# EasyEDA Pro project 宿舍管理.eprj

# Schematic Schematic1
Create Date: 2023-12-03; Page Name: P1; Project Name: 宿舍管理; Schematic Name: Schematic1; Update Date: 2023-12-23; Company: 嘉立创EDA; Page Size: A4; Version: V1.0
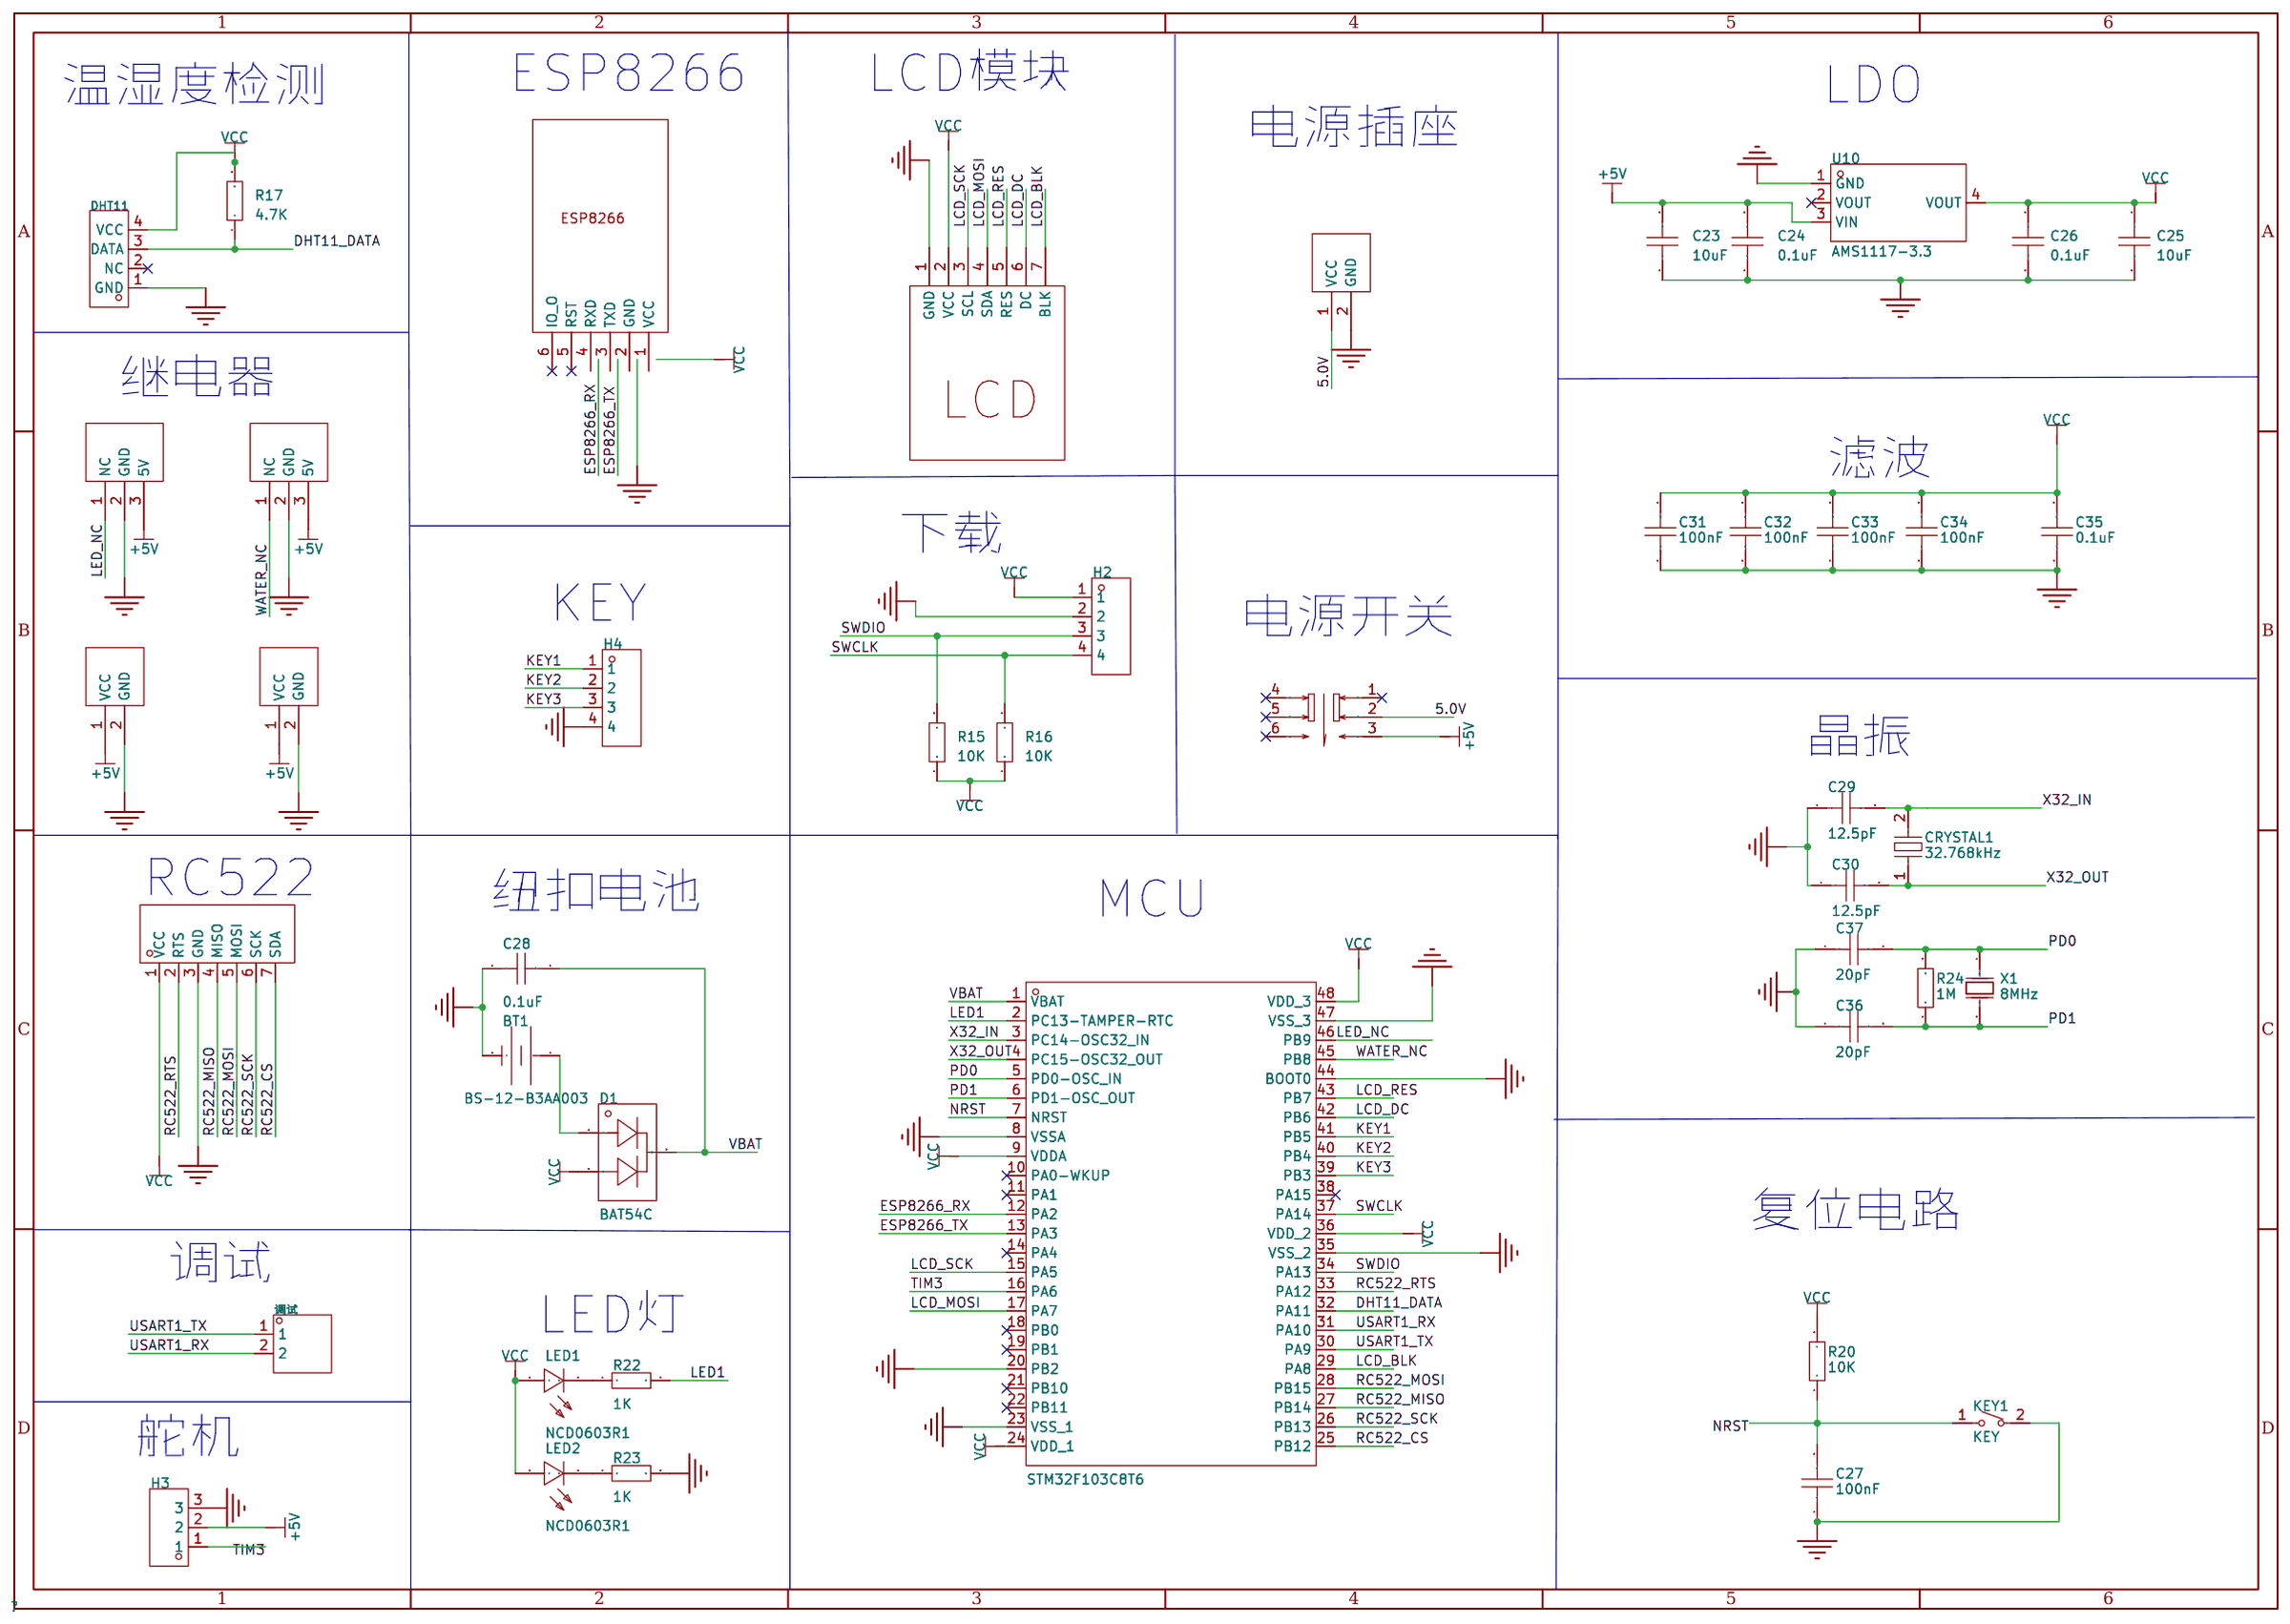
[diagram p0: schematic sheet]

## Parts
BT1  BS-12-B3AA003  [BAT-SMD_BS-12-B3AA011]
C23  10uF  [C0603]
C24  0.1uF  [C0603]
C25  10uF  [C0603]
C26  0.1uF  [C0603]
C27  100nF  [C0603]
C28  0.1uF  [C0603]
C29  12.5pF  [C0603]
C30  12.5pF  [C0603]
C31  100nF  [C0603]
C32  100nF  [C0603]
C33  100nF  [C0603]
C34  100nF  [C0603]
C35  0.1uF  [C0603]
C36  20pF  [C0603]
C37  20pF  [C0603]
CRYSTAL1  32.768kHz  [CRYSTAL-SMD_L3.2-W1.5-FC-135R32.7680KF-A3]
D1  BAT54C  [SOT-23-3_L2.9-W1.4-P1.91-LS2.6-BR]
DHT11  -  [HDR-TH_4P-P2.54-V-F]
H1  -  [HDR-TH_7P-P2.54-V-M]
H2  -  [HDR-TH_4P-P2.54-V-M]
H3  -  [HDR-TH_3P-P2.54-V-M]
H4  -  [HDR-TH_4P-P2.54-V-M]
KEY1  KEY  [SW-SMD_L6.0-W3.7-LS8.0]
LED1  NCD0603R1  [LED0603-RD_RED]
LED2  NCD0603R1  [LED0603-RD_RED]
R15  10K  [R0603]
R16  10K  [R0603]
R17  4.7K  [R0603]
R20  10K  [R0603]
R22  1K  [R0603]
R23  1K  [R0603]
R24  1M  [R0603]
SW1  TK-6700-1  [SW-TH_TK-6700-1]
U1  -  [正点原子ESP8266]
U2  -  [LCD-TFT]
U3  -  [电源2Pin]
U5  -  [电源3Pin]
U6  -  [电源3Pin]
U7  -  [电源2Pin]
U8  -  [电源2Pin]
U9  STM32F103C8T6  [LQFP-48_L7.0-W7.0-P0.50-LS9.0-BL]
U10  AMS1117-3.3  [SOT-223-3_L6.5-W3.4-P2.30-LS7.0-BR]
X1  8MHz  [CRYSTAL-SMD_L11.5-W4.8-LS12.7]
调试  -  [HDR-TH_2P-P2.54-V-M-1]

## Library data of the parts
BT1 = BS-12-B3AA003: 连接器类型:电池底座;适用电池规格:CR1220;工作温度范围:-25℃~+85℃;; LCSC Part Name: 电池底座 适用电池:CR1220; Supplier Part: C964723; Manufacturer: MYOUNG(美阳); Supplier Footprint: SMD; Datasheet: https://atta.szlcsc.com/upload/public/pdf/source/20201218/C964723_733B638E287393F86295A2A4DAE43C75.pdf; Supplier: LCSC; Connector Type: 电池底座; Battery Type: CR1220; Operating Temperature Range: -25℃~+85℃
C23-C37 = CAP_0603: Supplier Footprint: 0603
CRYSTAL1 = DF2032K76812001: 频率:32.768kHz;负载电容:12.5pF;频率公差:±20ppm;; LCSC Part Name: 32.768kHz ±20ppm 12.5pF; Supplier Part: C7294751; Manufacturer: HUAXIN(华昕); Supplier Footprint: SMD3215-2P; Datasheet: https://atta.szlcsc.com/upload/public/pdf/source/20230621/65B4E44CEC9FC4E2CAB0C2FAC7F63C7F.pdf; Supplier: LCSC; Crystal Type: 贴片无源晶振; Load Capacitance: 12.5pF; Equivalent Series Resistance (ESR): 60kΩ; Frequency Tolerance: ±20ppm; Frequency Stability: ±30ppm; Operating Temperature: -40℃~+85℃
D1 = BAT54C_C727125: 二极管配置:1对共阴极;正向压降(Vf):1V@100mA;直流反向耐压(Vr):30V;平均整流电流(Io):200mA;; LCSC Part Name: 电压:30V 电流:200mA; Supplier Part: C727125; Manufacturer: TWGMC(台湾迪嘉); Supplier Footprint: SOT-23; Datasheet: https://atta.szlcsc.com/upload/public/pdf/source/20200827/C727125_FA9D830E6485A4AEFAD08726CE8D43AC.pdf; Supplier: LCSC; Diode Configuration: 1对共阴极; Forward Voltage (Vf@If): 1V@100mA; Reverse Voltage (Vr): 30V; Average Rectified Current (Io): 200mA; Reverse Leakage Current (Ir): 2uA@25V
DHT11 = HDR-F_2.54_1x4P: Supplier Part: C2718488; Supplier Footprint: 插件; Supplier: LCSC; Manufacturer: BOOMELE(博穆精密); Manufacturer Part: 2.54-1*4P母; JLCPCB Part Class: Extended Part
H1 = HDR-M_2.54_1x7P: Supplier Part: C492406; Supplier Footprint: 插件; Supplier: LCSC; Manufacturer: XFCN(兴飞); Manufacturer Part: PZ254V-11-07P; JLCPCB Part Class: Extended Part
H2 H4 = HDR-M_2.54_1x4P: Supplier Part: C492403; Supplier Footprint: 插件
H3 = HDR-M_2.54_1x3P: Supplier Part: C2937625; Supplier Footprint: 插件
KEY1 = KEY: Supplier Part: C9900023212; Supplier Footprint: SW-SMD-2P; JLCPCB Part Class: 扩展库; Supplier: LCSC
LED1 LED2 = NCD0603R1_C84263: 发光颜色:红色;功率:65mW;透镜颜色:无色透明;主波长:615nm~630nm;发光强度:80mcd~220mcd;发光角度:130°;工作温度:-30℃~+85℃;; LCSC Part Name: 红灯 0603红灯   正贴; Supplier Part: C84263; Manufacturer: 国星光电; Supplier Footprint: 0603; JLCPCB Part Class: Extended Part; Datasheet: https://atta.szlcsc.com/upload/public/pdf/source/20200820/C84263_DABC6A75E58F576973B407FDBA283D60.pdf; Supplier: LCSC; Emitted Color: 红色; Forward Voltage (VF): 1.6V~2.6V; Forward Current: 20mA; Power Dissipation: 65mW; Lens Color: 无色透明; Dominant Wavelength: 615nm~630nm; Luminous Intensity: 80mcd~220mcd; Viewing Angle: 130°; Operating Temperature: -30℃~+85℃
R15-R17 R20 R22-R24 = Res_0603: Supplier Footprint: 0603
SW1 = TK-6700-1: LCSC Part Name: 自锁开关7*7*12.7有声有锁高导高柄插件双排6P按键开关带锁DIP六脚; Supplier Part: C528782; Manufacturer: Yuandi(元迪); Supplier Footprint: 插件; Datasheet: https://atta.szlcsc.com/upload/public/pdf/source/20200831/C528782_58F076EBF84BD8A9E2DE38DB1C0986D4.pdf; Supplier: LCSC
U1 = 正点原子ESP8266
U2 = LCD-TFT
U3 U7 U8 = 电源2Pin
U5 U6 = 电源3Pin
U9 = STM32F103C8T6: CPU内核:ARM Cortex-M3;CPU最大主频:72MHz;工作电压范围:2V~3.6V;程序存储容量:64KB;程序存储器类型:FLASH;RAM总容量:20KB;GPIO端口数量:37;; LCSC Part Name: STM32F103C8T6 MSL=3; Supplier Part: C8734; Manufacturer: ST(意法半导体); Supplier Footprint: LQFP-48(7x7); JLCPCB Part Class: 扩展库; Datasheet: https://atta.szlcsc.com/upload/public/pdf/source/20220812/8363ACEC51AD55ECEB84799464F7CB85.pdf; Supplier: LCSC; CPU Core: ARM Cortex-M3; CPU Maximum Speed: 72MHz; Operating Voltage Range: 2V~3.6V; Program Storage Size: 64KB; Program Memory Type: FLASH; RAM Size: 20KB; GPIO Ports Number: 37; ADC (Bit): 12bit; Universal Serial Bus: 有; Peripheral/Function: 看门狗；DMA；看门狗；片载温度传感器; Watchdog: 有; Infrared Data Association: 有; Low-Voltage Detect: 有; Direct Memory Access: 有; Internal Oscillator: 有; Operating Temperature Range: -40℃~+85℃
U10 = AMS1117-3.3_C6186: 输出类型:固定;最大输入电压:-;输出电压:3.3V;输出电流:1A;电源纹波抑制比(PSRR):72dB@(120Hz);输出极性:正;; LCSC Part Name: 输出3.3V 1A; Supplier Part: C6186; Manufacturer: AMS; Supplier Footprint: SOT-223-3; JLCPCB Part Class: 基础库; Datasheet: https://atta.szlcsc.com/upload/public/pdf/source/20180727/C6186_7A095716F0823C02F1997A905E26C086.pdf; Supplier: LCSC; Output Type: 固定; Output Voltage: 3.3V; Output Current: 1A; Power Supply Rejection Ratio (PSRR): 72dB@(120Hz); Dropout Voltage: 1.3V@(800mA); Output Polarity: 正; Number of Outputs: 1
X1 = X49SM8MSD2SC: 频率:8MHz;负载电容:20pF;频率公差:±20ppm;; LCSC Part Name: 8MHz ±20ppm 20pF HC-49SMD; Supplier Part: C12674; Manufacturer: YXC(扬兴晶振); Supplier Footprint: HC-49S-SMD; JLCPCB Part Class: 基础库; Datasheet: https://atta.szlcsc.com/upload/public/pdf/source/20210329/C106809_0E91E60850A780B284B63D653DC40EA4.pdf; Supplier: LCSC; Crystal Type: 49SMD; Load Capacitance: 20pF; Frequency Tolerance: ±20ppm; Frequency Stability: ±30ppm; Operating Temperature: -20℃~+70℃
调试 = HDR-M_2.54_1x2P: Supplier Part: C124375; Supplier Footprint: 插件

## Nets
5.0V: SW1.2 U3.1(VCC)
+5V: C23.2 C24.2 H3.2 SW1.3 U5.3(5V) U6.3(5V) U7.1(VCC) U8.1(VCC) U10.3(VIN)
GND: BT1.2(-) C23.1 C24.1 C25.2 C26.2 C27.1 C28.1 C29.1 C30.1 C31.1 C32.1 C33.1 C34.1 C35.1 C36.1 C37.1 DHT11.1(GND) H1.3(GND) H2.2 H3.3 H4.4 KEY1.2 R23.2 U2.1(GND) U3.2(GND) U5.2(GND) U6.2(GND) U7.2(GND) U8.2(GND) U9.8(VSSA) U9.20(PB2) U9.23(VSS_1) U9.35(VSS_2) U9.44(BOOT0) U9.47(VSS_3) U10.1(GND)
VBAT: C28.2 D1.3 U9.1(VBAT)
VCC: C25.1 C26.1 C31.2 C32.2 C33.2 C34.2 C35.2 D1.2 DHT11.4(VCC) H1.1(VCC) H2.1 LED1.2(A) LED2.2(A) R15.1 R16.1 R17.2 R20.2 U2.2(VCC) U9.9(VDDA) U9.24(VDD_1) U9.36(VDD_2) U9.48(VDD_3) U10.4(VOUT)
DHT11_DATA: DHT11.3(DATA) R17.1 U9.32(PA11)
ESP8266_RX: U9.12(PA2)
ESP8266_TX: U9.13(PA3)
KEY1: H4.1 U9.41(PB5)
KEY2: H4.2 U9.40(PB4)
KEY3: H4.3 U9.39(PB3)
LCD_BLK: U2.7(BLK) U9.29(PA8)
LCD_DC: U2.6(DC) U9.42(PB6)
LCD_MOSI: U2.4(SDA) U9.17(PA7)
LCD_RES: U2.5(RES) U9.43(PB7)
LCD_SCK: U2.3(SCL) U9.15(PA5)
LED1: R22.2 U9.2(PC13-TAMPER-RTC)
LED_NC: U5.1(NC) U9.46(PB9)
NRST: C27.2 KEY1.1 R20.1 U9.7(NRST)
PD0: C37.2 R24.2 U9.5(PD0-OSC_IN) X1.1(OSC1)
PD1: C36.2 R24.1 U9.6(PD1-OSC_OUT) X1.2(OSC2)
RC522_CS: H1.7(SDA) U9.25(PB12)
RC522_MISO: H1.4(MISO) U9.27(PB14)
RC522_MOSI: H1.5(MOSI) U9.28(PB15)
RC522_RTS: H1.2(RTS) U9.33(PA12)
RC522_SCK: H1.6(SCK) U9.26(PB13)
SWCLK: H2.4 R16.2 U9.37(PA14)
SWDIO: H2.3 R15.2 U9.34(PA13)
TIM3: H3.1 U9.16(PA6)
USART1_RX: U9.31(PA10) 调试.2
USART1_TX: U9.30(PA9) 调试.1
WATER_NC: U6.1(NC) U9.45(PB8)
X32_IN: C29.2 CRYSTAL1.2 U9.3(PC14-OSC32_IN)
X32_OUT: C30.2 CRYSTAL1.1 U9.4(PC15-OSC32_OUT)
$1N12932: BT1.1(+) D1.1
$1N13409: LED1.1(K) R22.1
$1N13480: LED2.1(K) R23.1

Not connected (* = marked no-connect by the designer): DHT11 2(NC)*; SW1 1* 4* 5* 6*; U1 1(VCC) 2(GND) 3(TXD) 4(RXD) 5(RST)* 6(IO_O)*; U9 10(PA0-WKUP)* 11(PA1)* 14(PA4)* 18(PB0)* 19(PB1)* 21(PB10)* 22(PB11)* 38(PA15)*; U10 2(VOUT)*

## Notes on the sheet
- 温湿度检测
- ESP8266
- LCD模块
- LDO
- 电源插座
- 继电器
- 滤波
- 下载
- KEY
- 电源开关
- 晶振
- RC522
- 纽扣电池
- MCU
- 复位电路
- 调试
- LED灯
- 舵机

# Board PCB1
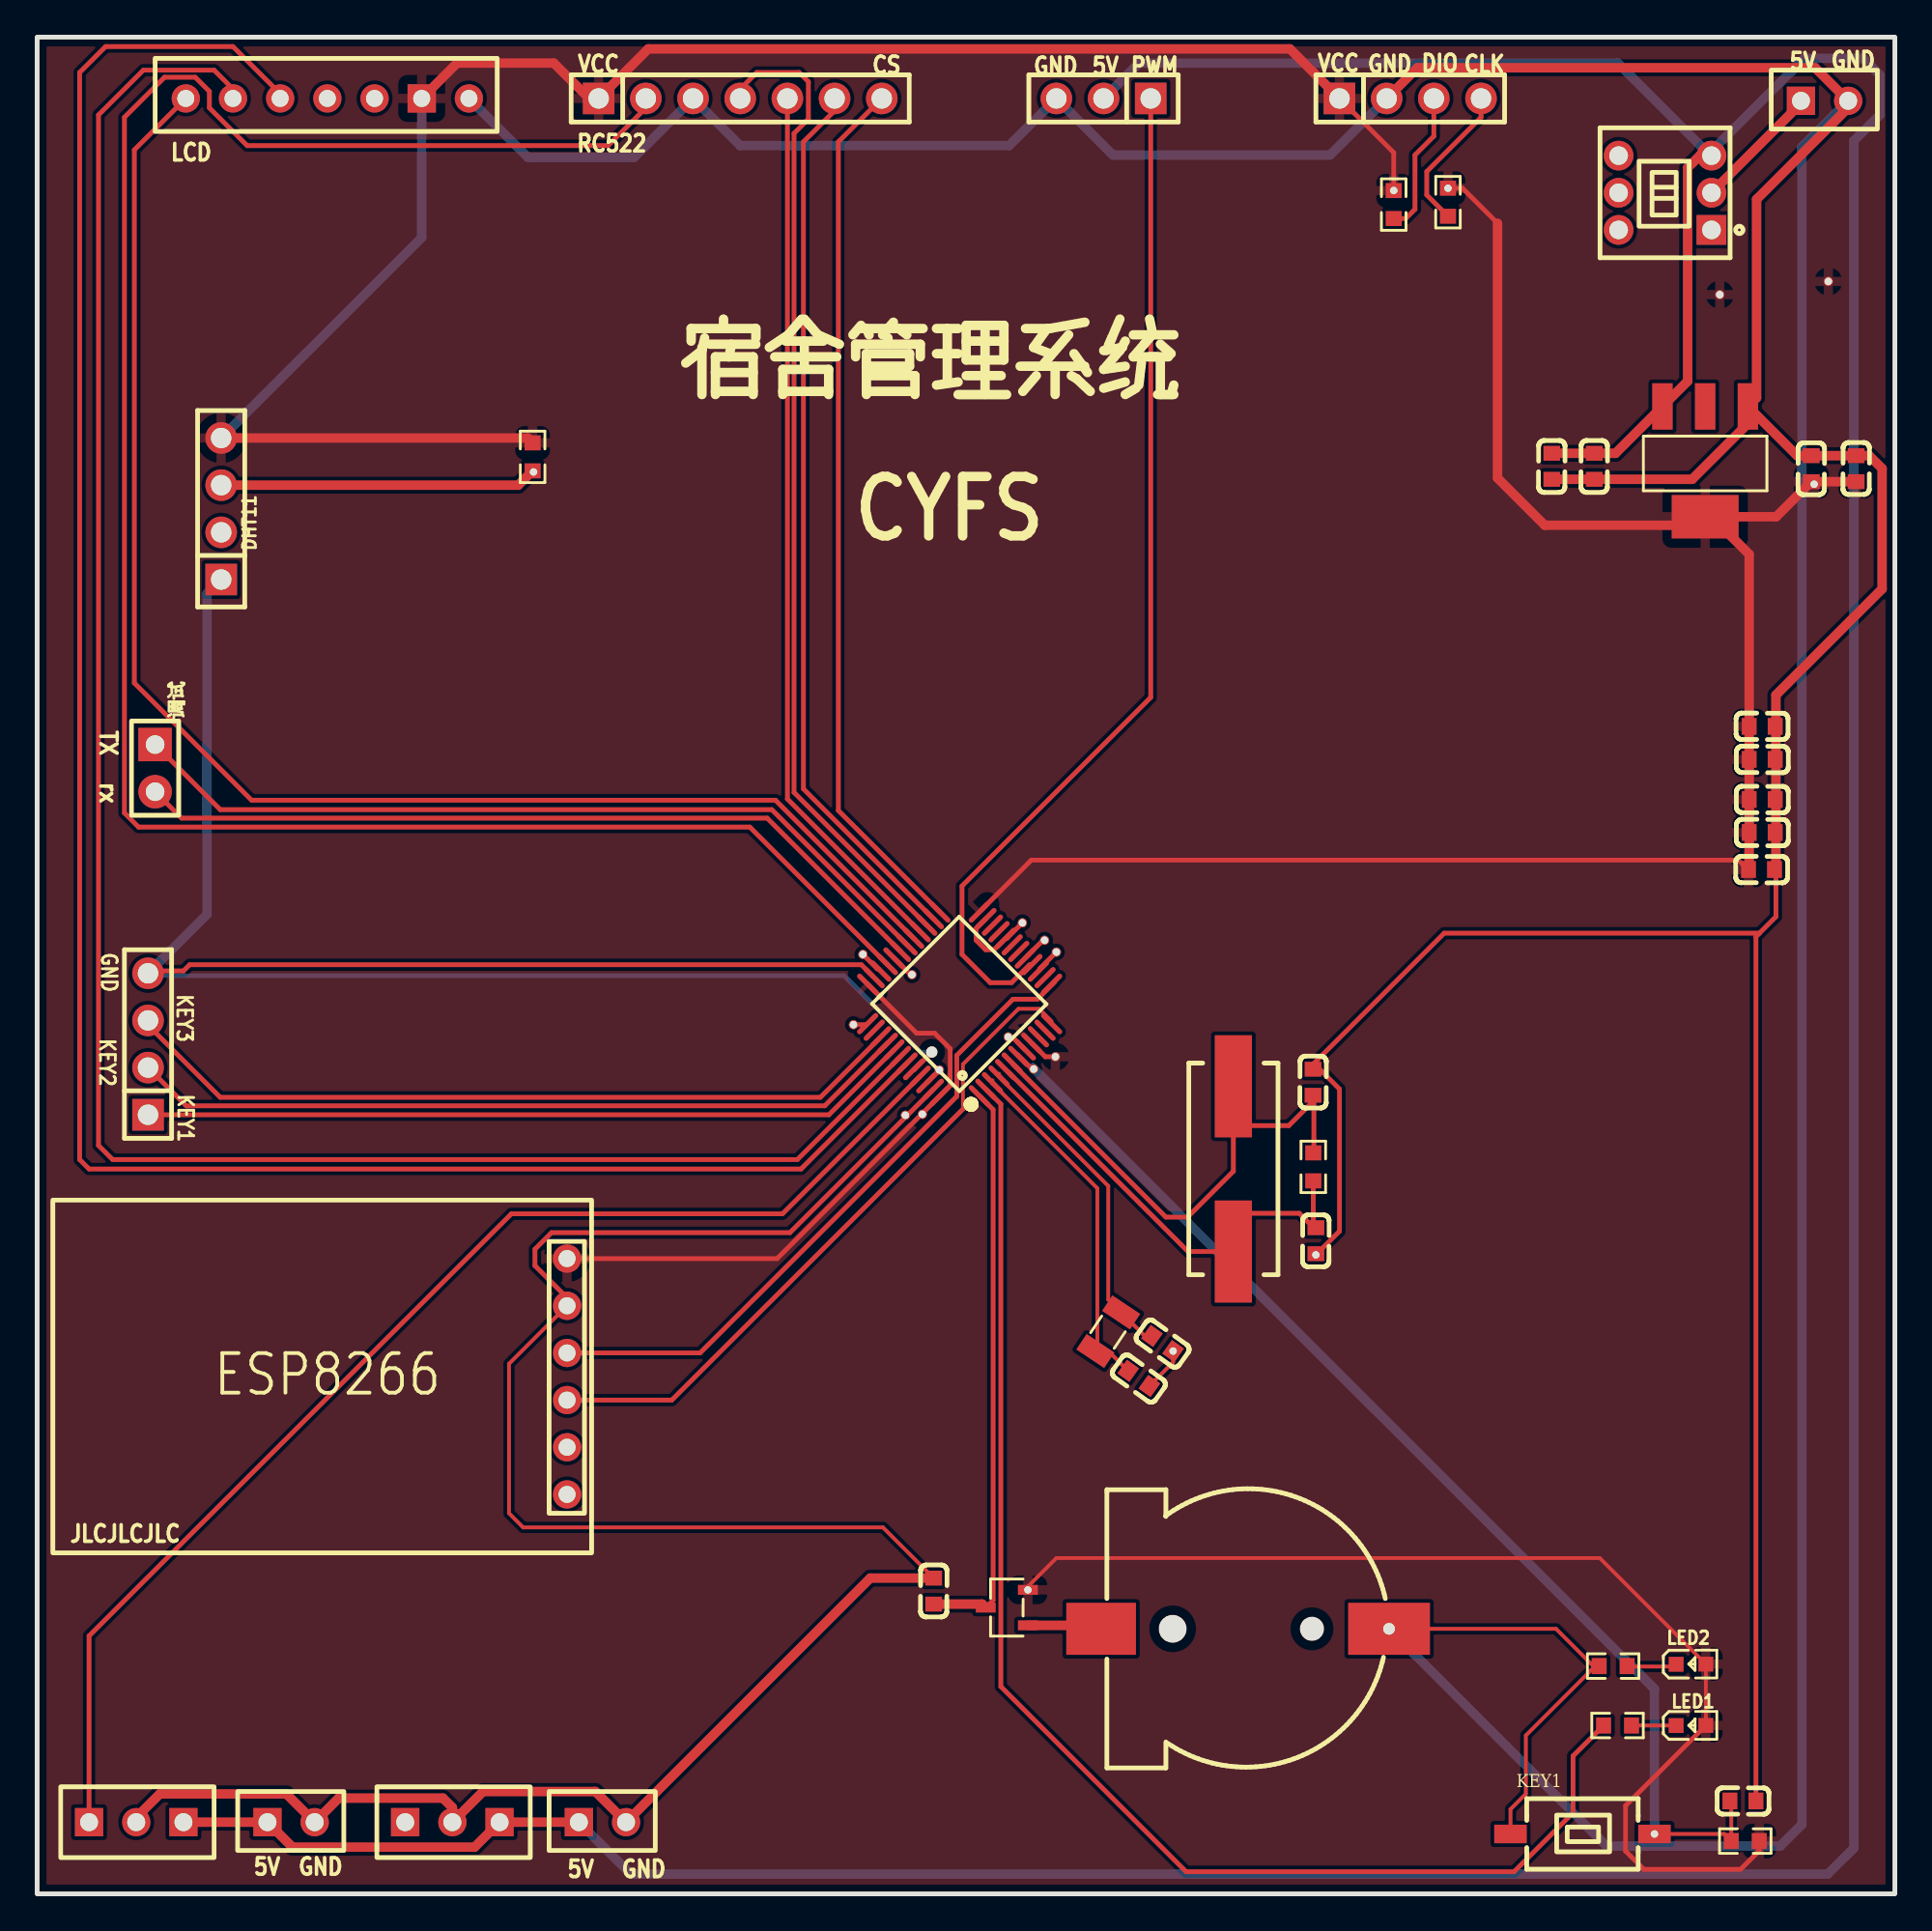
[diagram p1: board, top side]
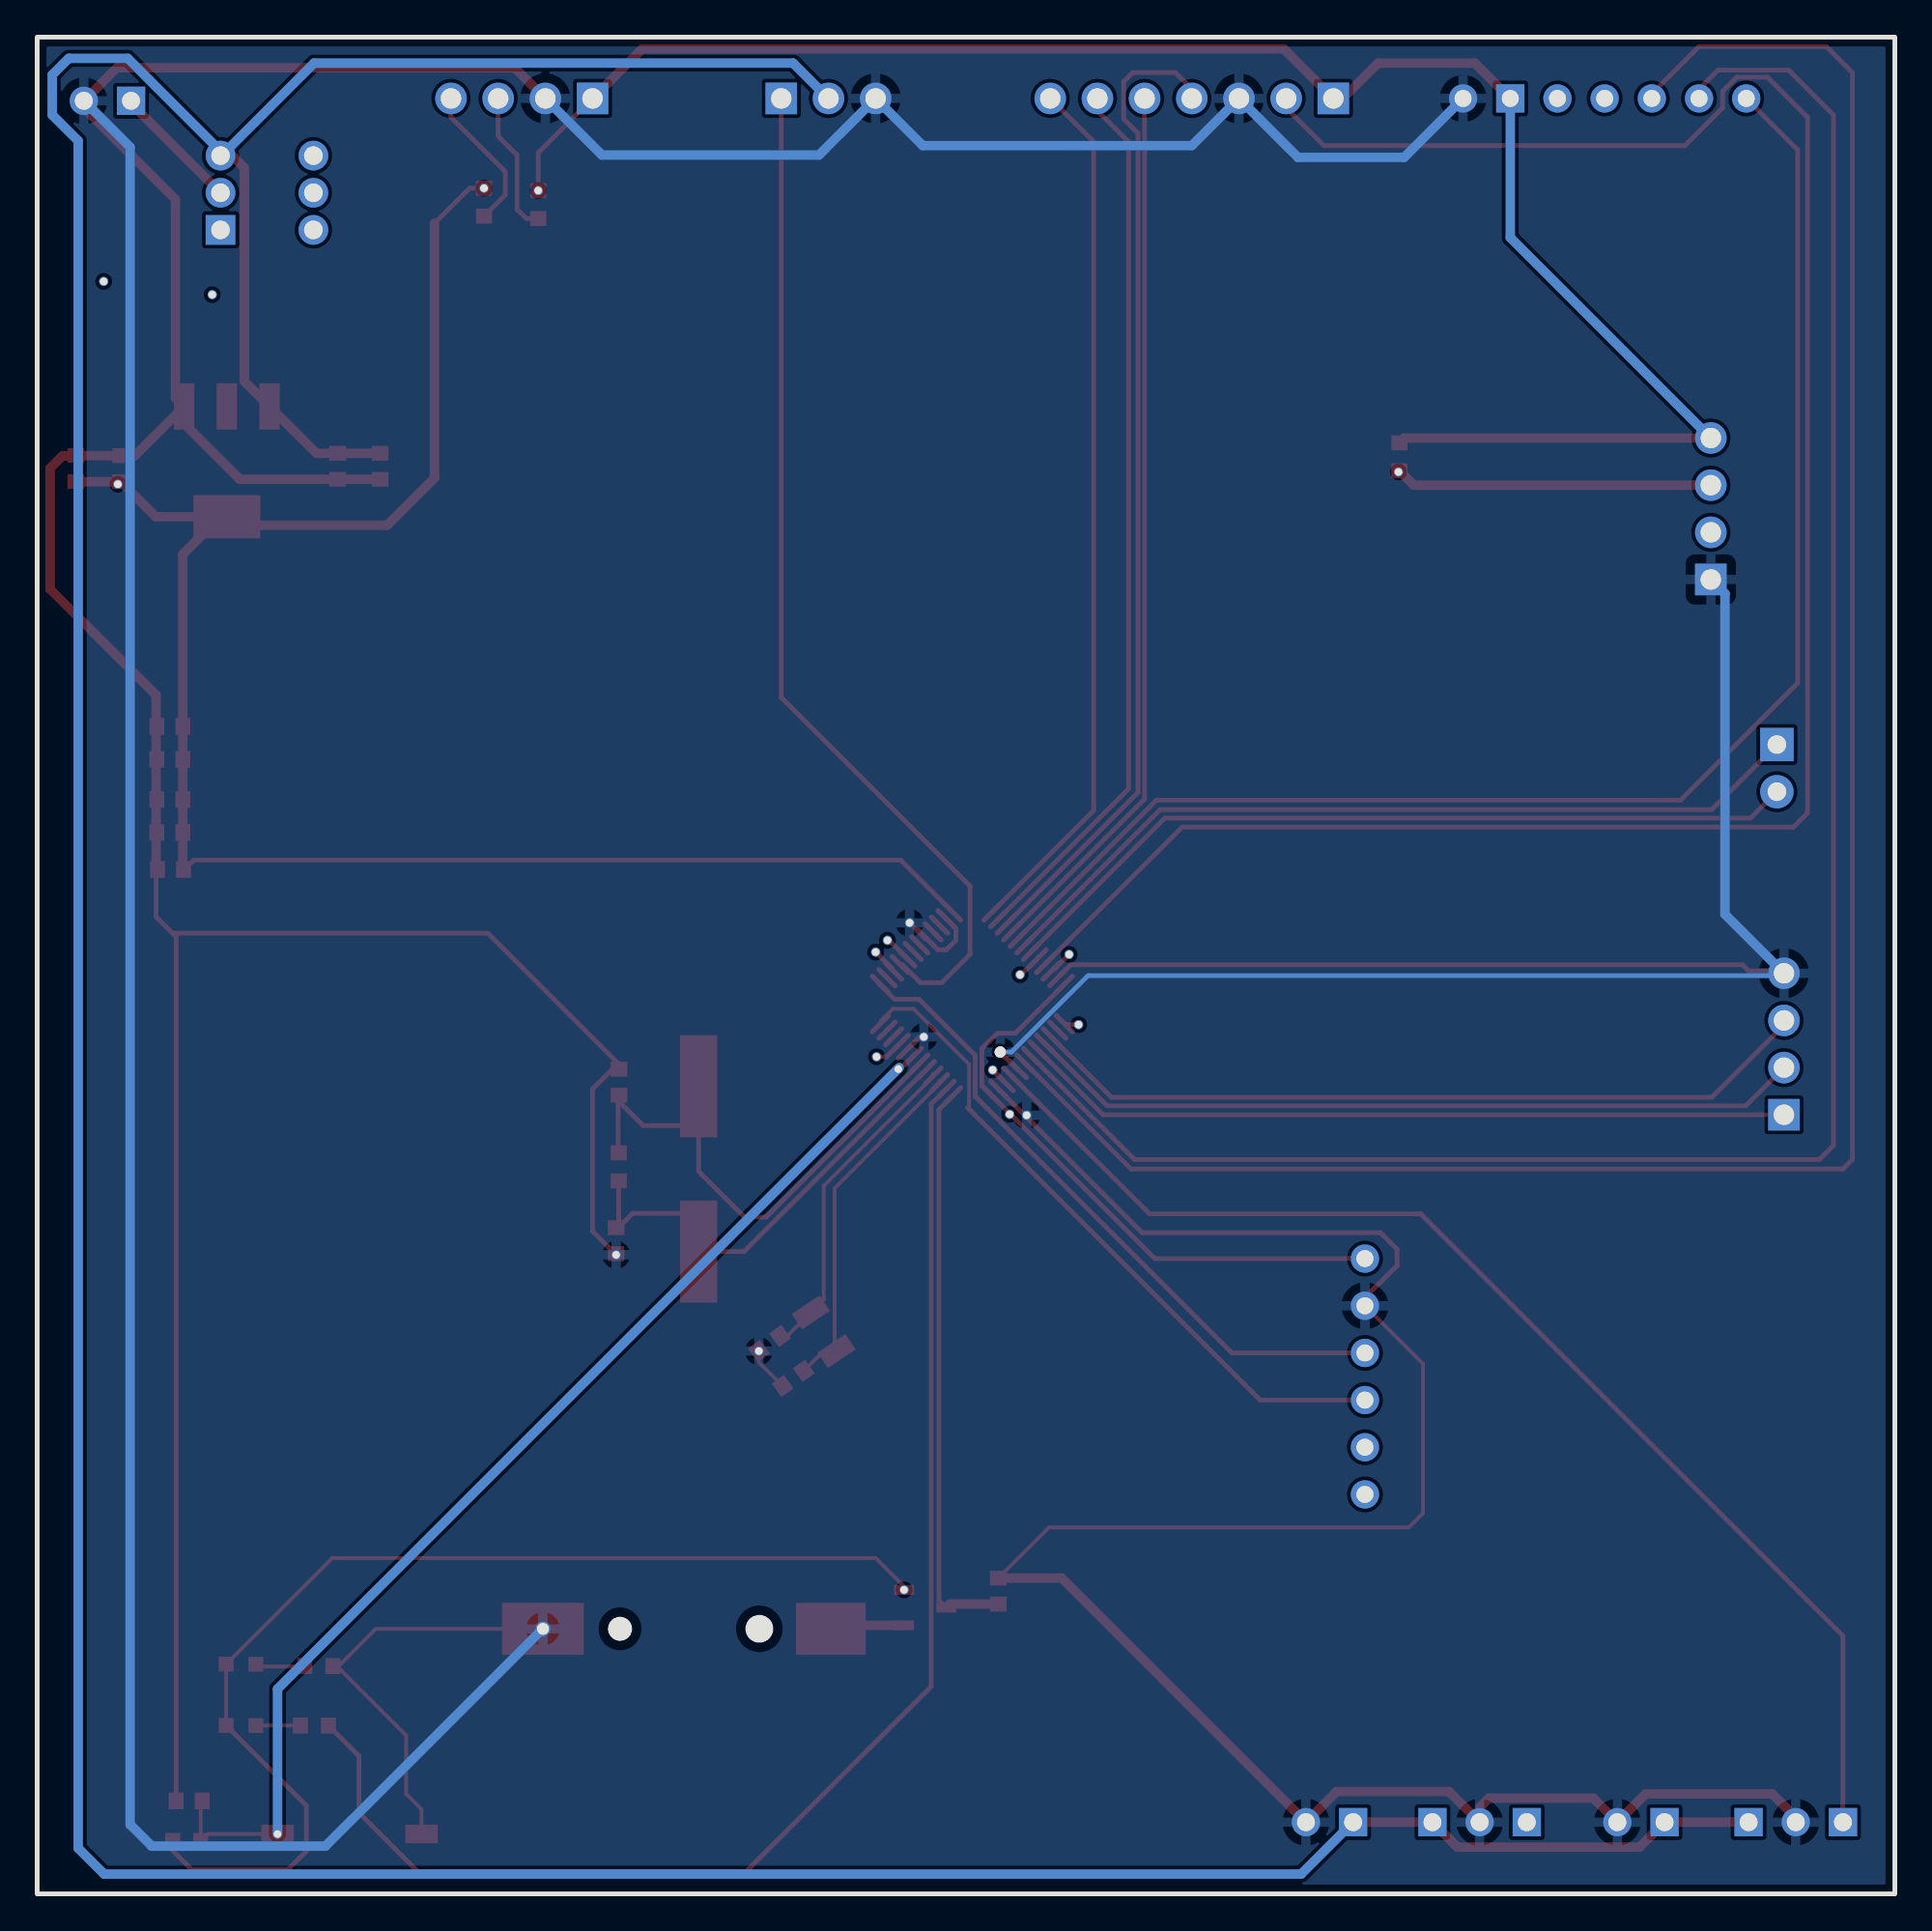
[diagram p2: board, bottom side, seen from below]

Outline 100 x 100 mm; copper layers: Top Layer, Inner1, Inner2, Bottom Layer. Coordinates in mm from the lower left corner of the outline.
Outline path: rectangle 0,100 100,0
Stack: Top Layer 0.035mm 外层铜厚1oz / Dielectric1 0.2104mm 7628 RC49% 8.6mil / Inner1 0.0152mm 内层铜厚 / Dielectric2 1.065mm 1.1mm H/HOZ 含铜 / Inner2 0.0152mm 内层铜厚 / Dielectric3 0.2104mm 7628 RC49% 8.6mil / Bottom Layer 0.035mm 外层铜厚1oz

## Design rules (mm)
template: JLCPCB Capability(Two Layers Board)
spacing copperThickness1oz (default): track to track 0.102, other pairs 0.152 to 0.3
spacing copperThickness2oz: track to track 0.203, other pairs 0.152 to 0.3
track width copperThickness1oz (default): min 0.127, default 0.254, max 2.54
track width copperThickness2oz: min 0.203, default 0.254, max 2.54
differential pair differentialPair (default): width min 0.127, default 0.254, max 2.54; gap min 0.152, default 0.152
via viaSize (default): diameter min 0.5, default 0.61, max 10; hole min 0.3, default 0.305, max 6.3

## Placement (name value [footprint] x y rotation side)
BT1  BS-12-B3AA003  [BAT-SMD_BS-12-B3AA011]  65.02 14.27 180 top
C23  10uF  [C0603]  81.53 76.89 90 top
C24  0.1uF  [C0603]  83.82 76.89 90 top
C25  10uF  [C0603]  95.5 76.76 90 top
C26  0.1uF  [C0603]  92.86 62.88 0 top
C27  100nF  [C0603]  91.82 5 180 top
C28  0.1uF  [C0603]  48.26 16.31 270 top
C29  12.5pF  [C0603]  59.3 27.76 144.5 top
C30  12.5pF  [C0603]  60.58 29.64 144.5 top
C31  100nF  [C0603]  92.86 58.94 180 top
C32  100nF  [C0603]  92.82 55.17 180 top
C33  100nF  [C0603]  92.86 57.16 180 top
C34  100nF  [C0603]  92.86 61.1 180 top
C35  0.1uF  [C0603]  97.92 76.76 270 top
C36  20pF  [C0603]  68.68 43.71 270 top
C37  20pF  [C0603]  68.83 35.18 90 top
CRYSTAL1  32.768kHz  [CRYSTAL-SMD_L3.2-W1.5-FC-135R32.7680KF-A3]  57.66 30.28 236.3 top
D1  BAT54C  [SOT-23-3_L2.9-W1.4-P1.91-LS2.6-BR]  52.2 15.42 0 top
DHT11  -  [HDR-TH_4P-P2.54-V-F]  9.91 74.6 90 top
H1  -  [HDR-TH_7P-P2.54-V-M]  37.85 96.7 0 top
H2  -  [HDR-TH_4P-P2.54-V-M]  73.91 96.7 0 top
H3  -  [HDR-TH_3P-P2.54-V-M]  57.4 96.7 180 top
H4  -  [HDR-TH_4P-P2.54-V-M]  5.97 45.77 90 top
KEY1  KEY  [SW-SMD_L6.0-W3.7-LS8.0]  83.19 3.23 180 top
LED1  NCD0603R1  [LED0603-RD_RED]  89.03 9.07 0 top
LED2  NCD0603R1  [LED0603-RD_RED]  89.03 12.37 0 top
NOREF  -  [Pad_e550]  54.81 45.08 0 top
NOREF#2  -  [Pad_e1]  47.09 49.5 0 top
NOREF#3  -  [Pad_e368]  72.77 14.27 0 top
NOREF#4  -  [Pad_e609]  53.03 52.3 0 top
NOREF#5  -  [Pad_e310]  87.06 3.23 0 top
NOREF#6  -  [Pad_e61]  26.72 76.58 0 top
NOREF#7  -  [Pad_e3343]  90.58 86.13 0 top
NOREF#8  -  [Pad_e606]  53.33 16.37 0 top
NOREF#9  -  [Pad_e648]  46.74 41.94 0 top
NOREF#10  -  [Pad_e618]  52.27 46.15 0 top
NOREF#11  -  [Pad_e731]  48.16 45.34 0 top
NOREF#12  -  [Pad_e653]  73.03 91.74 0 top
NOREF#13  -  [Pad_e40]  54.86 50.72 0 top
NOREF#14  -  [Pad_e654]  75.95 91.86 0 top
NOREF#15  -  [Pad_e3345]  95.66 75.92 0 top
NOREF#16  -  [Pad_e598]  48.56 44.37 0 top
NOREF#17  -  [Pad_e2259]  61.15 29.23 0 top
NOREF#18  -  [Pad_e305]  53.64 44.42 0 top
NOREF#19  -  [Pad_e395]  43.94 46.81 0 top
NOREF#20  -  [Pad_e3344]  96.42 86.84 0 top
NOREF#21  -  [Pad_e628]  47.65 41.99 0 top
NOREF#22  -  [Pad_e2260]  68.83 34.42 0 top
NOREF#23  -  [Pad_e1073]  54.23 51.36 0 top
NOREF#24  -  [Pad_e390]  44.45 50.6 0 top
R15  10K  [R0603]  73.03 90.98 270 top
R16  10K  [R0603]  75.95 91.11 270 top
R17  4.7K  [R0603]  26.67 77.39 90 top
R20  10K  [R0603]  91.95 2.84 0 top
R22  1K  [R0603]  85.07 9.07 180 top
R23  1K  [R0603]  84.84 12.27 180 top
R24  1M  [R0603]  68.69 39.15 270 top
SW1  TK-6700-1  [SW-TH_TK-6700-1]  87.63 91.62 90 top
U1  -  [正点原子ESP8266]  29.84 27.86 90 top
U2  -  [LCD-TFT]  15.62 95.17 180 top
U3  -  [电源2Pin]  95.88 96.32 0 top
U5  -  [电源3Pin]  22.35 3.86 0 top
U6  -  [电源3Pin]  5.33 3.86 0 top
U7  -  [电源2Pin]  30.1 3.61 0 top
U8  -  [电源2Pin]  13.33 3.61 0 top
U9  STM32F103C8T6  [LQFP-48_L7.0-W7.0-P0.50-LS9.0-BL]  49.66 47.93 45 top
U10  AMS1117-3.3  [SOT-223-3_L6.5-W3.4-P2.30-LS7.0-BR]  89.79 77.14 90 top
X1  8MHz  [CRYSTAL-SMD_L11.5-W4.8-LS12.7]  64.39 39.04 90 top
调试  -  [HDR-TH_2P-P2.54-V-M-1]  6.35 60.63 270 top

## Footprints (pads in the part's own frame, mm; a bottom-side part is the same pattern mirrored in y, then rotated)
BAT-SMD_BS-12-B3AA011
  rect 3.75x2.8 smd: 1(7.75,0)
  rect 4.4x2.8 smd: 2(-7.75,0)
C0603
  rect 0.8x0.9 smd: 1(-0.7,0) 2(0.7,0)
CRYSTAL-SMD_L3.2-W1.5-FC-135R32.7680KF-A3
  rect 1x1.8 smd: 1(-1.25,0) 2(1.25,0)
CRYSTAL-SMD_L11.5-W4.8-LS12.7
  rect 5.5x2 smd: 1(-4.45,0) 2(4.45,0)
HDR-TH_2P-P2.54-V-M-1
  rect 1.8x1.8 hole 1: 1(-1.27,0)
  round 1.8 hole 1: 2(1.27,0)
HDR-TH_3P-P2.54-V-M
  rect 1.7x1.7 hole 1.1: 1(-2.54,0)
  round 1.7 hole 1.1: 2(0,0) 3(2.54,0)
HDR-TH_4P-P2.54-V-F
  rect 1.7x1.7 hole 1.1: 1(-3.81,0)
  round 1.7 hole 1.1: 2(-1.27,0) 3(1.27,0) 4(3.81,0)
HDR-TH_4P-P2.54-V-M
  rect 1.7x1.7 hole 1.1: 1(-3.81,0)
  round 1.7 hole 1.1: 2(-1.27,0) 3(1.27,0) 4(3.81,0)
HDR-TH_7P-P2.54-V-M
  rect 1.7x1.7 hole 1.1: 1(-7.62,0)
  round 1.7 hole 1.1: 2(-5.08,0) 3(-2.54,0) 4(0,0) 5(2.54,0) 6(5.08,0) 7(7.62,0)
LCD-TFT
  round 1.524 hole 0.914: 1(-7.62,-1.524) 3(-2.54,-1.524) 4(0,-1.524) 5(2.54,-1.524) 6(5.08,-1.524) 7(7.62,-1.524)
  rect 1.524x1.524 hole 0.914: 2(-5.08,-1.524)
LED0603-RD_RED
  rect 0.8x0.8 smd: 1(-0.799,-0.004) 2(0.799,0.004)
LQFP-48_L7.0-W7.0-P0.50-LS9.0-BL
  oval 0.27x1.5 smd: 1(-2.75,-4.25) 2(-2.25,-4.25) 3(-1.75,-4.25) 4(-1.25,-4.25) 5(-0.75,-4.25) 6(-0.25,-4.25) 7(0.25,-4.25) 8(0.75,-4.25) 9(1.25,-4.25) 10(1.75,-4.25) 11(2.25,-4.25) 12(2.75,-4.25) 25(2.75,4.25) 26(2.25,4.25) 27(1.75,4.25) 28(1.25,4.25) 29(0.75,4.25) 30(0.25,4.25) 31(-0.25,4.25) 32(-0.75,4.25) 33(-1.25,4.25) 34(-1.75,4.25) 35(-2.25,4.25) 36(-2.75,4.25)
  oval 1.5x0.27 smd: 13(4.25,-2.75) 14(4.25,-2.25) 15(4.25,-1.75) 16(4.25,-1.25) 17(4.25,-0.75) 18(4.25,-0.25) 19(4.25,0.25) 20(4.25,0.75) 21(4.25,1.25) 22(4.25,1.75) 23(4.25,2.25) 24(4.25,2.75) 37(-4.25,2.75) 38(-4.25,2.25) 39(-4.25,1.75) 40(-4.25,1.25) 41(-4.25,0.75) 42(-4.25,0.25) 43(-4.25,-0.25) 44(-4.25,-0.75) 45(-4.25,-1.25) 46(-4.25,-1.75) 47(-4.25,-2.25) 48(-4.25,-2.75)
Pad_e1
  round 0.5 hole 0.4: 72(0,0)
Pad_e40
  round 0.5 hole 0.4: 49(0,0)
Pad_e61
  round 0.5 hole 0.4: 73(0,0)
Pad_e305
  round 0.5 hole 0.4: 50(0,0)
Pad_e310
  round 0.5 hole 0.4: 52(0,0)
Pad_e368
  round 0.8 hole 0.63: 53(0,0)
Pad_e390
  round 0.5 hole 0.4: 54(0,0)
Pad_e395
  round 0.5 hole 0.4: 55(0,0)
Pad_e550
  round 0.5 hole 0.4: 56(0,0)
Pad_e598
  round 0.5 hole 0.4: 58(0,0)
Pad_e606
  round 0.5 hole 0.4: 59(0,0)
Pad_e609
  round 0.5 hole 0.4: 60(0,0)
Pad_e618
  round 0.5 hole 0.4: 61(0,0)
Pad_e628
  round 0.5 hole 0.4: 62(0,0)
Pad_e648
  round 0.5 hole 0.4: 63(0,0)
Pad_e653
  round 0.5 hole 0.4: 64(0,0)
Pad_e654
  round 0.5 hole 0.4: 65(0,0)
Pad_e731
  round 0.6 hole 0.914x0.4: 57(0,0)
Pad_e1073
  round 0.5 hole 0.4: 51(0,0)
Pad_e2259
  round 0.5 hole 0.4: 66(0,0)
Pad_e2260
  round 0.5 hole 0.4: 67(0,0)
Pad_e3343
  round 0.5 hole 0.4: 69(0,0)
Pad_e3344
  round 0.5 hole 0.4: 70(0,0)
Pad_e3345
  round 0.5 hole 0.4: 71(0,0)
R0603
  rect 0.806x0.864 smd: 1(-0.753,0) 2(0.753,0)
SOT-23-3_L2.9-W1.4-P1.91-LS2.6-BR
  rect 1.07x0.532 smd: 1(1.135,-0.955) 2(1.135,0.955) 3(-1.135,0)
SOT-223-3_L6.5-W3.4-P2.30-LS7.0-BR
  rect 2.5x1.1 smd: 1(2.97,-2.3) 2(2.97,0) 3(2.97,2.3)
  rect 2.34x3.6 smd: 4(-2.97,0)
SW-SMD_L6.0-W3.7-LS8.0
  rect 1.75x1 smd: 1(-3.875,0) 2(3.875,0)
SW-TH_TK-6700-1
  rect 1.6x1.6 hole 1: 1(-2,-2.5)
  round 1.6 hole 1: 2(0,-2.5) 3(2,-2.5) 4(-2,2.5) 5(0,2.5) 6(2,2.5)
正点原子ESP8266
  round 1.524 hole 0.914: 1(6.35,1.32) 2(3.81,1.32) 3(1.27,1.32) 4(-1.27,1.32) 5(-3.81,1.32) 6(-6.35,1.32)
电源2Pin
  rect 1.524x1.524 hole 0.965: 1(-0.938,0.254)
  round 1.524 hole 0.965: 2(1.603,0.254)
电源3Pin
  rect 1.524x1.524 hole 0.965: 1(-2.54,0) 3(2.54,0)
  round 1.524 hole 0.965: 2(0,0)

## Nets
5.0V: SW1.2 U3.1
+5V: C23.2 C24.2 H3.2 SW1.3 U5.3 U6.3 U7.1 U8.1 U10.3
GND: BT1.2 C23.1 C24.1 C25.2 C26.2 C27.1 C28.1 C29.1 C30.1 C31.1 C32.1 C33.1 C34.1 C35.1 C36.1 C37.1 DHT11.1 H1.3 H2.2 H3.3 H4.4 KEY1.2 NOREF#3.53 NOREF#4.60 NOREF#9.63 NOREF#10.61 NOREF#11.57 NOREF#17.66 NOREF#22.67 R23.2 U1.2 U2.1 U3.2 U5.2 U6.2 U7.2 U8.2 U9.8 U9.20 U9.23 U9.35 U9.44 U9.47 U10.1
VBAT: C28.2 D1.3 U9.1
VCC: C25.1 C26.1 C31.2 C32.2 C33.2 C34.2 C35.2 D1.2 DHT11.4 H1.1 H2.1 LED1.2 LED2.2 NOREF.56 NOREF#7.69 NOREF#8.59 NOREF#12.64 NOREF#14.65 NOREF#15.71 NOREF#20.70 NOREF#21.62 R15.1 R16.1 R17.2 R20.2 U1.1 U2.2 U9.9 U9.24 U9.36 U9.48 U10.4
DHT11_DATA: DHT11.3 NOREF#2.72 NOREF#6.73 R17.1 U9.32
ESP8266_RX: U1.4 U9.12
ESP8266_TX: U1.3 U9.13
KEY1: H4.1 U9.41
KEY2: H4.2 U9.40
KEY3: H4.3 U9.39
LCD_BLK: U2.7 U9.29
LCD_DC: U2.6 U9.42
LCD_MOSI: NOREF#23.51 U2.4 U9.17
LCD_RES: U2.5 U9.43
LCD_SCK: NOREF#13.49 U2.3 U9.15
LED1: R22.2 U9.2
LED_NC: NOREF#16.58 U5.1 U9.46
NRST: C27.2 KEY1.1 NOREF#5.52 NOREF#18.50 R20.1 U9.7
PD0: C37.2 R24.2 U9.5 X1.1
PD1: C36.2 R24.1 U9.6 X1.2
RC522_CS: H1.7 U9.25
RC522_MISO: H1.4 U9.27
RC522_MOSI: H1.5 U9.28
RC522_RTS: H1.2 U9.33
RC522_SCK: H1.6 U9.26
SWCLK: H2.4 NOREF#19.55 R16.2 U9.37
SWDIO: H2.3 NOREF#24.54 R15.2 U9.34
TIM3: H3.1 U9.16
USART1_RX: U9.31 调试.2
USART1_TX: U9.30 调试.1
WATER_NC: U6.1 U9.45
X32_IN: C29.2 CRYSTAL1.2 U9.3
X32_OUT: C30.2 CRYSTAL1.1 U9.4
$1N12932: BT1.1 D1.1
$1N13409: LED1.1 R22.1
$1N13480: LED2.1 R23.1

Pads without a net: DHT11 2; SW1 1 4 5 6; U1 5 6; U9 10 11 14 18 19 21 22 38; U10 2

## Routing (per net, layer and track width the routed paths; a pad name or vN(x,y) marks a point on that pad's centre or on a via; arc(x,y) is an arc through that point)
5.0V: length 6.9
  Top Layer w0.508: SW1.2 94.95,96.44 U3.1
+5V: length 258.1
  Top Layer w0.508: U6.3 U8.1 13.74,2.51 23.55,2.51 U5.3 U7.1 ; SW1.3 89.5,93.62 88.85,92.96 88.85,81.47 87.49,80.11 84.97,77.59 C24.2 C23.2
  Bottom Layer w0.508: U7.1 31.96,1.07 96.39,1.07 97.79,2.46 97.79,94.41 99.19,95.81 99.19,97.97 98.3,98.86 95.12,98.86 90.13,93.86 SW1.3 90.07,93.62 85.09,98.6 59.31,98.6 H3.2
GND: length 678.9
  Top Layer w0.203: KEY1.2 79.31,4.56 80.14,5.38 80.14,8.53 83.82,12.22 81.76,14.27 NOREF#3.53 ; C29.1 61.15,28.63 NOREF#17.66 ; U1.2 25.4,28.55 25.4,20.5 26.16,19.74 45.53,19.74 C28.1
  Top Layer w0.254: NOREF#10.61 52.5,46.15 53.19,45.45 ; U9.44 47.21,44.39 NOREF#11.57 ; 92.71,51.74 92.52,51.55 C27.1 ; 92.71,51.74 75.74,51.74 68.73,44.73 70.1,43.35 70.1,35.69 68.73,34.31 ; 92.71,51.74 93.6,52.63 93.6,55.09 C32.1 ; U1.2 28.53,32.1 26.8,33.83 26.8,34.72 27.69,35.61 40.52,35.61 U9.47 ; H4.4 6.1,49.71 7.87,49.71 8.21,50.04 44.36,50.04 44.93,49.47 ; NOREF#4.60 52.2,51.47 U9.20 51.52,50.85 51.05,50.85 50.55,51.36 50.55,52 51.07,52.53
  Top Layer w0.508: H2.2 74.29,98.35 95.71,98.35 U3.2 97.49,96.19 92.56,91.26 92.56,80.58 U10.1 ; C32.1 93.6,55.25 93.6,64.57 99.31,70.28 99.31,76.77 98.62,77.46 C35.1 C25.2 94.74,77.46 U10.1 ; U10.1 92.09,79.19 89.09,76.19 C24.1 C23.1 ; U6.2 5.33,4.11 6.6,5.38 13.41,5.38 U8.2 16.23,5.16 21.84,5.16 22.35,4.65 U5.2 24,5.51 30.05,5.51 U7.2 44.85,17.01 C28.1
  Inner1 w0.254: NOREF#4.60 62.74,52.3 71.88,43.15 71.88,36.65 69.65,34.42 NOREF#22.67
  Inner1 w0.508: NOREF#4.60 53.03,50.16 47.88,45.01 47.88,43.28 46.74,42.14 NOREF#9.63
  Inner2 w0.254: NOREF#11.57 51.46,45.34 NOREF#10.61
  Inner2 w0.508: NOREF#11.57 46.74,43.92 NOREF#9.63 ; NOREF#17.66 64.12,29.23 68.83,33.95 NOREF#22.67
  Bottom Layer w0.254: NOREF#11.57 47.55,45.34 43.43,49.45 6.1,49.45 H4.4
  Bottom Layer w0.508: U3.2 95,94.08 95,3.73 93.83,2.57 84.48,2.57 NOREF#3.53 ; U2.1 26.42,93.52 32.13,93.52 H1.3 37.85,94.16 52.32,94.16 H3.3 57.91,93.65 69.6,93.65 H2.2 ; H4.4 9.14,52.76 9.14,70.03 DHT11.1
VBAT: length 30.9
  Top Layer w0.254: U9.1 51.46,42.24 51.46,15.82 D1.3
  Top Layer w0.508: C28.2 50.87,15.61 D1.3
VCC: length 470.7
  Top Layer w0.203: LED1.2 LED2.2 84.11,18.08 54.86,18.08 53.33,16.55 NOREF#8.59
  Top Layer w0.254: U9.36 47.34,46.35 48.31,46.35 49.15,45.52 49.15,43.53 U9.48 39.83,34.21 U1.1 ; NOREF.56 54.27,45.08 U9.9 ; NOREF#12.64 73.03,93.78 H2.1 ; R20.2 92.7,2.33 91.69,1.32 86.49,1.32 85.5,2.3 85.5,4.75 LED1.2 ; NOREF#14.65 76.73,91.86 78.61,89.98 ; C32.2 92.07,55.17 91.57,55.68 53.52,55.68 50.85,53.01
  Top Layer w0.508: DHT11.4 26.41,78.41 R17.2 ; H2.1 67.44,99.36 32.89,99.36 H1.1 29.72,96.7 27.81,98.6 22.61,98.6 U2.2 ; 90.13,74.17 93.61,74.17 C25.1 C35.2 ; 90.13,74.17 92.16,72.15 C26.1 C34.2 C31.2 C33.2 92.16,55.21 C32.2 ; 90.13,74.17 U10.4 89.33,73.71 81.15,73.71 78.61,76.25 78.61,89.98
  Inner1 w0.508: NOREF.56 55.73,44.17 55.73,18.77 NOREF#8.59 ; NOREF#15.71 96.42,76.68 NOREF#20.70 95.71,86.13 NOREF#7.69
  Inner2 w0.254: H2.1 58.93,85.52 58.93,41.45 51.69,34.21 U1.1
  Inner2 w0.508: NOREF#12.64 75.82,91.74 NOREF#14.65 ; U1.1 42.9,19.84 51.36,19.84 53.33,17.86 NOREF#8.59
  Bottom Layer w0.508: U2.2 20.7,89.2 DHT11.4
DHT11_DATA: length 56.2
  Top Layer w0.254: NOREF#2.72 47.02,49.5 46.12,50.4
  Top Layer w0.508: DHT11.3 25.9,75.87 R17.1
  Inner1 w0.254: NOREF#2.72 43.28,49.5 42.77,50.01 42.77,60.53 NOREF#6.73
ESP8266_RX: length 36.6
  Top Layer w0.203: 54.61,47 53.94,47.67 52.82,47.67 49.83,44.68 49.83,42.42 49.91,42.34
  Top Layer w0.254: U1.4 34.16,26.59 49.91,42.34
ESP8266_TX: length 35.8
  Top Layer w0.254: 54.78,49.11 53.85,48.18 52.53,48.18 49.5,45.16 49.5,42.95 35.69,29.13 U1.3
KEY1: length 41.6
  Top Layer w0.254: 46.12,45.45 46.12,45.45 42.62,41.96 H4.1
KEY2: length 42
  Top Layer w0.254: H4.2 8.03,42.44 42.4,42.44 45.76,45.81 U9.40
KEY3: length 42.6
  Top Layer w0.254: 45.35,46.09 42.16,42.9 9.85,42.9 5.97,46.79 H4.3
LCD_BLK: length 80.3
  Top Layer w0.254: U2.7 5.23,93.93 5.23,65.21 11.54,58.9 39.75,58.9 U9.29
LCD_DC: length 110.5
  Top Layer w0.254: U2.6 10.54,97.21 9.52,98.22 5.71,98.22 3.3,95.81 3.3,40.31 4.06,39.55 40.92,39.55 46.47,45.1
LCD_MOSI: length 62.8
  Top Layer w0.254: 53.19,50.4 54.15,51.36 NOREF#23.51
  Inner2 w0.254: NOREF#23.51 54.23,58.09 U2.4
LCD_RES: length 118.3
  Top Layer w0.254: U2.5 13.08,96.95 10.54,99.49 3.68,99.49 2.29,98.09 2.29,39.55 2.79,39.04 41.12,39.04 U9.43
LCD_SCK: length 62.4
  Top Layer w0.254: NOREF#13.49 53.96,49.82
  Inner2 w0.254: NOREF#13.49 54.86,58.98 18.16,95.68 U2.3
LED1: length 74.1
  Top Layer w0.254: 84.32,9.07 82.68,7.43 82.68,4.37 79.5,1.19 61.85,1.19 51.88,11.17 51.88,42.54 51.07,43.34
LED_NC: length 53.4
  Top Layer w0.254: NOREF#16.58 48.56,44.36 U9.46
  Inner1 w0.254: NOREF#16.58 48.56,32.61 U5.1
NRST: length 62.7
  Top Layer w0.203: C27.2 91.19,4.93 R20.1 90.81,3.23 NOREF#5.52
  Top Layer w0.254: 53.57,44.49 53.48,44.49 52.75,45.22
  Bottom Layer w0.508: NOREF#5.52 87.06,11.03 53.59,44.5
PD0: length 25
  Top Layer w0.254: 52.3,44.24 61.95,34.59 X1.1 64.39,36.48 64.57,36.65 67.94,36.65 68.69,35.9 ; 68.69,38.15 68.69,35.9 ; 68.69,35.9 68.73,35.87
PD1: length 28.5
  Top Layer w0.254: X1.2 64.39,41.7 ; 64.39,41.7 64.72,41.38 67.38,41.38 68.73,42.73 68.73,40.19 68.69,40.15 ; 64.39,41.7 64.39,38.92 61.92,36.45 60.76,36.45 52.53,44.67
RC522_CS: length 47.1
  Top Layer w0.254: H1.7 43.13,94.36 43.13,58.35 U9.25
RC522_MISO: length 53.5
  Top Layer w0.254: H1.4 37.85,97.21 38.73,98.09 41.02,98.09 41.52,97.6 41.52,95.59 40.74,94.82 40.74,59.32 U9.27
RC522_MOSI: length 47.8
  Top Layer w0.254: 47.54,51.82 40.39,58.97 H1.5
RC522_RTS: length 114.3
  Top Layer w0.254: H1.2 32.77,96.19 30.73,94.16 11.3,94.16 9.27,96.19 9.27,97.08 8.51,97.84 6.86,97.84 4.7,95.68 4.7,58.22 5.46,57.45 38.36,57.45 U9.33
RC522_SCK: length 47.8
  Top Layer w0.254: U9.26 48.24,52.53 41.25,59.51 41.25,94.36 42.93,96.04 H1.6
SWCLK: length 73.8
  Top Layer w0.254: U9.37 44.65,46.81 NOREF#19.55 ; H2.4 77.72,95.68 74.8,92.76 74.8,91.5 R16.2
  Inner1 w0.254: H2.4 76.58,95.55 76.58,78.13 44.86,46.41 44.35,46.41 NOREF#19.55
SWDIO: length 67.7
  Top Layer w0.254: H2.3 75.18,94.67 74.17,93.65 74.17,90.73 73.67,90.23 R15.2 ; NOREF#24.54 45.22,49.82 45.29,49.82
  Inner1 w0.254: H2.3 75.18,81.33 NOREF#24.54
TIM3: length 55
  Top Layer w0.254: H3.1 59.94,64.44 49.78,54.28 49.78,50.6 51.31,49.07 52.45,49.07 53.43,50.05
USART1_RX: length 43.7
  Top Layer w0.254: 调试.2 7.77,57.94 39.3,57.94 46.47,50.76
USART1_TX: length 44.9
  Top Layer w0.254: U9.30 39.55,58.39 9.85,58.39 调试.1
WATER_NC: length 67.3
  Top Layer w0.254: U6.1 2.79,13.89 25.53,36.63 40.12,36.63 47.54,44.04
X32_IN: length 19.2
  Top Layer w0.203: C29.2 57.66,29.24 56.96,29.24 57.07,29.34 57.07,38 51.42,43.65 51.42,43.81
X32_OUT: length 17.8
  Top Layer w0.203: 60.01,30.05 59.62,30.05 CRYSTAL1.1 57.66,32.01 57.66,38.13 51.78,44.01 51.78,44.17
$1N12932: length 4
  Top Layer w0.508: BT1.1 57.09,14.46 D1.1
$1N13409: length 2.4
  Top Layer w0.203: R22.1 88.22,9.07 LED1.1
$1N13480: length 2.7
  Top Layer w0.203: LED2.1 88.1,12.24 85.61,12.24 R23.1

## Copper pours and planes (outline as drawn; the poured copper is in the pictures)
GND on Bottom Layer: 0,100 100,100 100,0 0,0
VCC on Top Layer: 0,100 100,100 100,0 0,0

## Text on the board
Top Silkscreen Layer: KEY2 | GND | KEY3 | KEY1 | JLCJLCJLC | 5V | RC522 | VCC | CS | PWM | DIO | CLK | TX | rx | LCD | ESP8266 | CYFS | 宿舍管理系统
